# Altium schematic sheet BMS_AFE.SchDoc
size Tabloid; SheetNumber: 1; SheetTotal: 3
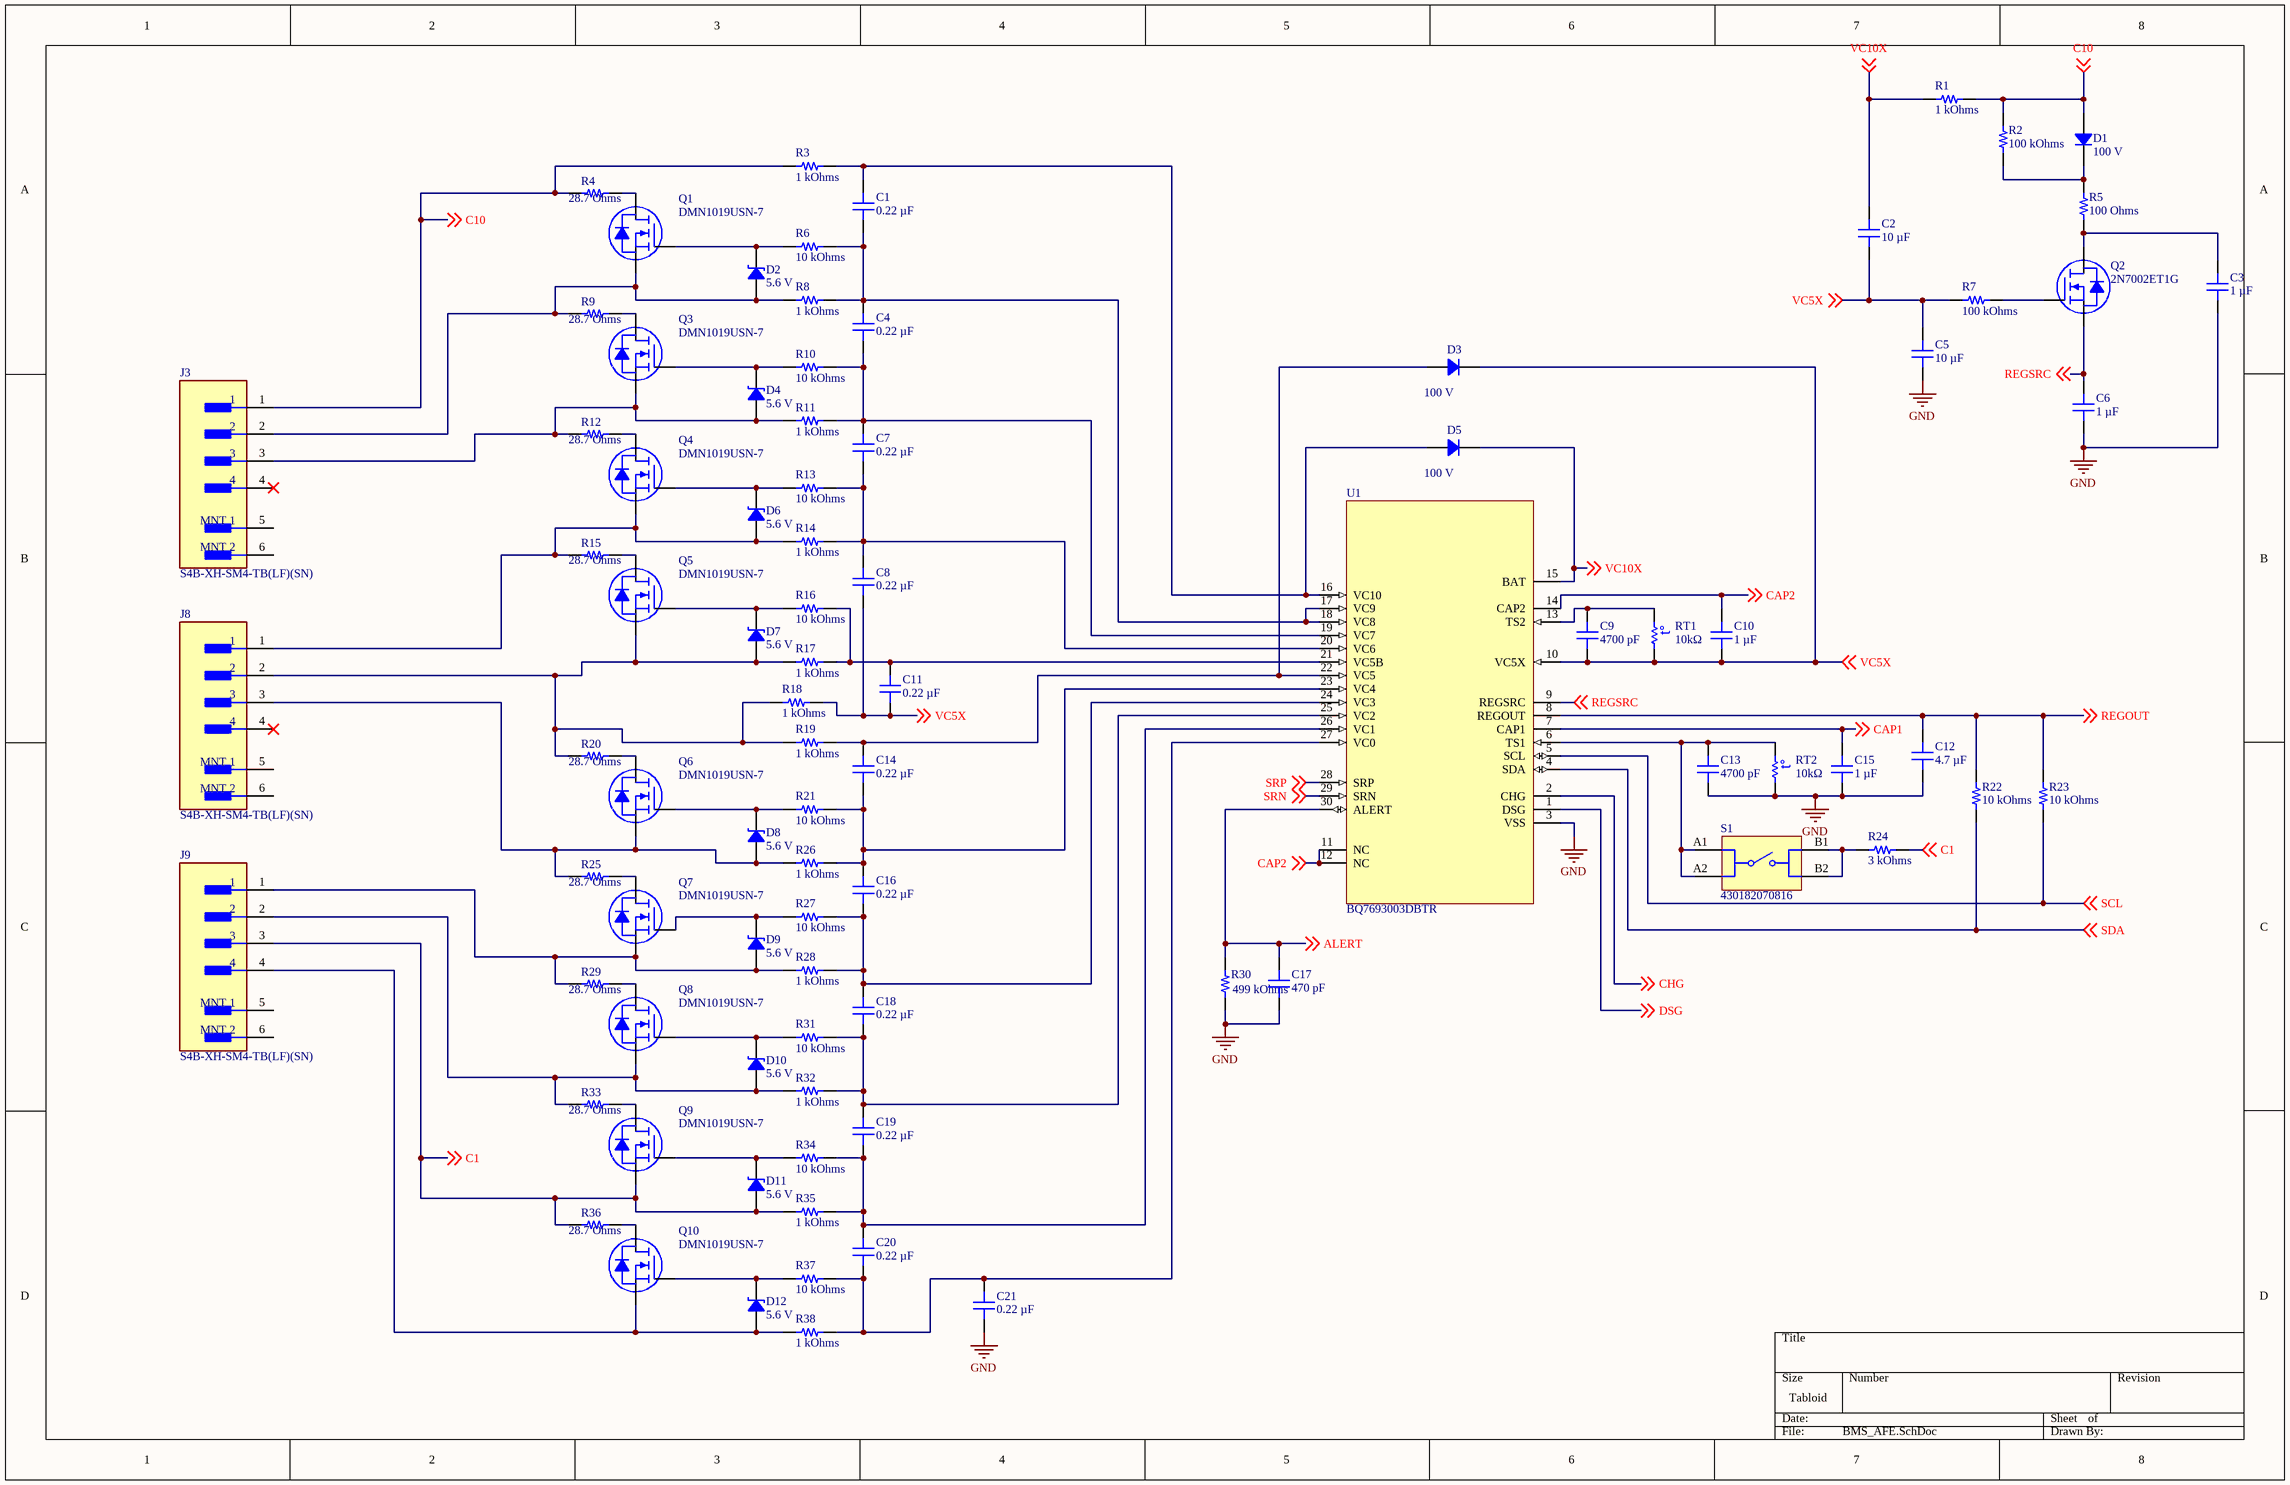
[diagram p0: BMS_AFE.SchDoc]

## Parts
C1  0.22 µF  [CAP 0603_1608]
C2  10 µF  [CAP 1210_3225 - 1MM]
C3  1 µF  [CAP 0805_2012]
C4  0.22 µF  [CAP 0603_1608]
C5  10 µF  [CAP 1210_3225 - 1MM]
C6  1 µF  [CAP 0805_2012]
C7  0.22 µF  [CAP 0603_1608]
C8  0.22 µF  [CAP 0603_1608]
C9  4700 pF  [CAP 0603_1608]
C10  1 µF  [CAP 0603_1608]
C11  0.22 µF  [CAP 0603_1608]
C12  4.7 µF  [CAP 0805_2012]
C13  4700 pF  [CAP 0603_1608]
C14  0.22 µF  [CAP 0603_1608]
C15  1 µF  [CAP 0603_1608]
C16  0.22 µF  [CAP 0603_1608]
C17  470 pF  [CAP 0603_1608]
C18  0.22 µF  [CAP 0603_1608]
C19  0.22 µF  [CAP 0603_1608]
C20  0.22 µF  [CAP 0603_1608]
C21  0.22 µF  [CAP 0603_1608]
D1  Voltage - DC Reverse (Vr) (Max): 100 V  [SOD-123]  (hidden comment: 1N4148W-7-F)
D2  Voltage - Zener (Nom) (Vz): 5.6 V  [SOD323]  (hidden comment: MMSZ5232BS-7-F)
D3  Voltage - DC Reverse (Vr) (Max): 100 V  [SOD-123]  (hidden comment: 1N4148W-7-F)
D4  Voltage - Zener (Nom) (Vz): 5.6 V  [SOD323]  (hidden comment: MMSZ5232BS-7-F)
D5  Voltage - DC Reverse (Vr) (Max): 100 V  [SOD-123]  (hidden comment: 1N4148W-7-F)
D6  Voltage - Zener (Nom) (Vz): 5.6 V  [SOD323]  (hidden comment: MMSZ5232BS-7-F)
D7  Voltage - Zener (Nom) (Vz): 5.6 V  [SOD323]  (hidden comment: MMSZ5232BS-7-F)
D8  Voltage - Zener (Nom) (Vz): 5.6 V  [SOD323]  (hidden comment: MMSZ5232BS-7-F)
D9  Voltage - Zener (Nom) (Vz): 5.6 V  [SOD323]  (hidden comment: MMSZ5232BS-7-F)
D10  Voltage - Zener (Nom) (Vz): 5.6 V  [SOD323]  (hidden comment: MMSZ5232BS-7-F)
D11  Voltage - Zener (Nom) (Vz): 5.6 V  [SOD323]  (hidden comment: MMSZ5232BS-7-F)
D12  Voltage - Zener (Nom) (Vz): 5.6 V  [SOD323]  (hidden comment: MMSZ5232BS-7-F)
J3  S4B-XH-SM4-TB(LF)(SN)  [FP-S4B-XH-SM4-TB_LF_SN-MFG]
J8  S4B-XH-SM4-TB(LF)(SN)  [FP-S4B-XH-SM4-TB_LF_SN-MFG]
J9  S4B-XH-SM4-TB(LF)(SN)  [FP-S4B-XH-SM4-TB_LF_SN-MFG]
Q1  DMN1019USN-7  [DIODES SOT-23-3]
Q2  2N7002ET1G  [ON SEMI SOT-23-3]
Q3  DMN1019USN-7  [DIODES SOT-23-3]
Q4  DMN1019USN-7  [DIODES SOT-23-3]
Q5  DMN1019USN-7  [DIODES SOT-23-3]
Q6  DMN1019USN-7  [DIODES SOT-23-3]
Q7  DMN1019USN-7  [DIODES SOT-23-3]
Q8  DMN1019USN-7  [DIODES SOT-23-3]
Q9  DMN1019USN-7  [DIODES SOT-23-3]
Q10  DMN1019USN-7  [DIODES SOT-23-3]
R1  1 kOhms  [RES 0603_1608]
R2  100 kOhms  [RES 0805_2012]
R3  1 kOhms  [RES 0603_1608]
R4  28.7 Ohms  [RES 2512_6432]
R5  100 Ohms  [RES 0805_2012]
R6  10 kOhms  [RES 0603_1608]
R7  100 kOhms  [RES 0805_2012]
R8  1 kOhms  [RES 0603_1608]
R9  28.7 Ohms  [RES 2512_6432]
R10  10 kOhms  [RES 0603_1608]
R11  1 kOhms  [RES 0603_1608]
R12  28.7 Ohms  [RES 2512_6432]
R13  10 kOhms  [RES 0603_1608]
R14  1 kOhms  [RES 0603_1608]
R15  28.7 Ohms  [RES 2512_6432]
R16  10 kOhms  [RES 0603_1608]
R17  1 kOhms  [RES 0603_1608]
R18  1 kOhms  [RES 0603_1608]
R19  1 kOhms  [RES 0603_1608]
R20  28.7 Ohms  [RES 2512_6432]
R21  10 kOhms  [RES 0603_1608]
R22  10 kOhms  [RES 0603_1608]
R23  10 kOhms  [RES 0603_1608]
R24  3 kOhms  [RES 0603_1608]
R25  28.7 Ohms  [RES 2512_6432]
R26  1 kOhms  [RES 0603_1608]
R27  10 kOhms  [RES 0603_1608]
R28  1 kOhms  [RES 0603_1608]
R29  28.7 Ohms  [RES 2512_6432]
R30  499 kOhms  [RES 0603_1608]
R31  10 kOhms  [RES 0603_1608]
R32  1 kOhms  [RES 0603_1608]
R33  28.7 Ohms  [RES 2512_6432]
R34  10 kOhms  [RES 0603_1608]
R35  1 kOhms  [RES 0603_1608]
R36  28.7 Ohms  [RES 2512_6432]
R37  10 kOhms  [RES 0603_1608]
R38  1 kOhms  [RES 0603_1608]
RT1  Resistance: 10kΩ  [FP-103AT-2-MFG]  (hidden comment: 103AT-2)
RT2  Resistance: 10kΩ  [FP-103AT-2-MFG]  (hidden comment: 103AT-2)
S1  430182070816  [430182070816]
U1  BQ7693003DBTR  [FP-DBT0030A-IPC_C]

## Nets
GND: C3.1 C5.1 C6.1 C12.1 C13.1 C15.2 C17.1 C21.1 R30.1 RT2.1 U1.3(VSS)
ALERT: C17.2 R30.2 U1.30(ALERT) ; off-sheet ALERT
C1: D11.1 J9.3 Q9.2(S) R24.2 R35.1 R36.1 ; off-sheet C1
C10: D1.1 J3.1 R1.2 R2.2 R3.1 R4.1 ; off-sheet C10
CAP1: C15.1 U1.7(CAP1) ; off-sheet CAP1
CAP2: C10.1 U1.11(NC) U1.12(NC) U1.14(CAP2) ; off-sheet CAP2
CHG: U1.2(CHG) ; off-sheet CHG
DSG: U1.1(DSG) ; off-sheet DSG
REGOUT: C12.2 R22.2 R23.2 U1.8(REGOUT) ; off-sheet REGOUT
REGSRC: C6.2 Q2.2(S) U1.9(REGSRC) ; off-sheet REGSRC
SCL: R23.1 U1.5(SCL) ; off-sheet SCL
SDA: R22.1 U1.4(SDA) ; off-sheet SDA
SRN: U1.29(SRN) ; off-sheet SRN
SRP: U1.28(SRP) ; off-sheet SRP
VC5X: C2.1 C5.2 C8.1 C9.1 C10.2 C11.1 D3.2 R7.1 R18.2 RT1.1 U1.10(VC5X) ; off-sheet VC5X
VC10X: C2.2 D5.2 R1.1 U1.15(BAT) ; off-sheet VC10X
NetC1_1: C1.1 C4.2 R6.2 R8.2 U1.17(VC9) U1.18(VC8)
NetC1_2: C1.2 D5.1 R3.2 U1.16(VC10)
NetC3_2: C3.2 Q2.3(D) R5.1
NetC4_1: C4.1 C7.2 R10.2 R11.2 U1.19(VC7)
NetC7_1: C7.1 C8.2 R13.2 R14.2 U1.20(VC6)
NetC9_2: C9.2 RT1.2 U1.13(TS2)
NetC11_2: C11.2 R16.2 R17.2 U1.21(VC5B)
NetC13_2: C13.2 RT2.2 S1.A1 S1.A2 U1.6(TS1)
NetC14_1: C14.1 C16.2 R21.2 R26.2 U1.23(VC4)
NetC14_2: C14.2 D3.1 R19.2 U1.22(VC5)
NetC16_1: C16.1 C18.2 R27.2 R28.2 U1.24(VC3)
NetC18_1: C18.1 C19.2 R31.2 R32.2 U1.25(VC2)
NetC19_1: C19.1 C20.2 R34.2 R35.2 U1.26(VC1)
NetC20_1: C20.1 C21.2 R37.2 R38.2 U1.27(VC0)
NetD1_2: D1.2 R2.1 R5.2
NetD2_1: D2.1 J3.2 Q1.2(S) R8.1 R9.1
NetD2_2: D2.2 Q1.1(G) R6.1
NetD4_1: D4.1 J3.3 Q3.2(S) R11.1 R12.1
NetD4_2: D4.2 Q3.1(G) R10.1
NetD6_1: D6.1 J8.1 Q4.2(S) R14.1 R15.1
NetD6_2: D6.2 Q4.1(G) R13.1
NetD7_1: D7.1 J8.2 Q5.2(S) R17.1 R18.1 R19.1 R20.1
NetD7_2: D7.2 Q5.1(G) R16.1
NetD8_1: D8.1 J8.3 Q6.2(S) R25.1 R26.1
NetD8_2: D8.2 Q6.1(G) R21.1
NetD9_1: D9.1 J9.1 Q7.2(S) R28.1 R29.1
NetD9_2: D9.2 Q7.1(G) R27.1
NetD10_1: D10.1 J9.2 Q8.2(S) R32.1 R33.1
NetD10_2: D10.2 Q8.1(G) R31.1
NetD11_2: D11.2 Q9.1(G) R34.1
NetD12_1: D12.1 J9.4 Q10.2(S) R38.1
NetD12_2: D12.2 Q10.1(G) R37.1
NetQ1_3: Q1.3(D) R4.2
NetQ2_1: Q2.1(G) R7.2
NetQ3_3: Q3.3(D) R9.2
NetQ4_3: Q4.3(D) R12.2
NetQ5_3: Q5.3(D) R15.2
NetQ6_3: Q6.3(D) R20.2
NetQ7_3: Q7.3(D) R25.2
NetQ8_3: Q8.3(D) R29.2
NetQ9_3: Q9.3(D) R33.2
NetQ10_3: Q10.3(D) R36.2
NetR24_1: R24.1 S1.B1 S1.B2

Not connected (* = marked no-connect by the designer): J3 4* 5(MNT_1) 6(MNT_2); J8 4* 5(MNT_1) 6(MNT_2); J9 5(MNT_1) 6(MNT_2)

## Notes on the sheet
- (in symbol 103AT-2) t°

## Library data of the parts
C1 C4 C7 C8 C11 C14 C16 C18-C21 = 885012206048: CAP CER 0.22UF 16V X7R 0603; manufacturer: Würth Elektronik; Tolerance: ±10%; Part Number: 885012206048; Capacitance: 0.22 µF; Applications: General Purpose; componentlink1description: Datasheet; componentlink1url: https://katalog.we-online.de/pbs/datasheet/885012206048.pdf; componentlink2description: DigiKey Link; componentlink2url: https://www.digikey.com/en/products/detail/würth-elektronik/885012206048/5453822; Device Package: 0603 (1608 Metric); lastupdated: 2/9/2024 8:10:22 PM; Lifecycle Status: Active; Minimum Order: 1; Mounting Type: Surface Mount, MLCC; Operating Temperature: -55°C ~ 125°C; Package / Case: 0603 (1608 Metric); packaging: TapeAndReel; partid: 8781; Part Status: Active; price: 0.03; series: WCAP-CSGP; Size / Dimension: 0.063" L x 0.031" W (1.60mm x 0.80mm); Supplier 1: DigiKey; Supplier Part Number 1: 732-7967-1-ND; Temperature Coefficient: X7R; Thickness (Max): 0.034" (0.87mm); value: 0.22 µF; Voltage - Rated: 16V
C2 C5 = CL32B106KLJNNNE: CAP CER 10UF 35V X7R 1210; manufacturer: Samsung Electro-Mechanics; Tolerance: ±10%; Part Number: CL32B106KLJNNNE; Value: 10 µF; Applications: General Purpose; Capacitance: 10 µF; componentlink1description: Datasheet; componentlink1url: http://www.samsungsem.com/kr/support/product-search/mlcc/CL32B106KLJNNNE.jsp; componentlink2description: DigiKey Link; componentlink2url: https://www.digikey.com/en/products/detail/samsung-electro-mechanics/CL32B106KLJNNNE/3889047; Device Package: 1210 (3225 Metric); lastupdated: 6/4/2024 7:20:58 PM; Lifecycle Status: Active; Minimum Order: 1; Mounting Type: Surface Mount, MLCC; Operating Temperature: -55°C ~ 125°C; Package / Case: 1210 (3225 Metric); packaging: TapeAndReel; partid: 41408; Part Status: Active; price: 0.08; series: CL; Size / Dimension: 0.126" L x 0.098" W (3.20mm x 2.50mm); Supplier 1: DigiKey; Supplier Part Number 1: 1276-3389-1-ND; Temperature Coefficient: X7R; Thickness (Max): 0.106" (2.70mm); Voltage - Rated: 35V
C3 C6 = GCJ21BR71H105KA01L: CAP CER 1UF 50V X7R 0805; manufacturer: Murata Electronics; Tolerance: ±10%; Part Number: GCJ21BR71H105KA01L; Capacitance: 1 µF; Applications: Automotive, Boardflex Sensitive; componentlink1description: Datasheet; componentlink1url: https://www.murata.com/~/media/webrenewal/support/library/catalog/products/capacitor/mlcc/c03e.ashx?la=en-us; componentlink2description: DigiKey Link; componentlink2url: https://www.digikey.com/en/products/detail/murata-electronics/GCJ21BR71H105KA01L/4903512; Device Package: 0805 (2012 Metric); Features: Soft Termination; lastupdated: 2/9/2024 8:16:08 PM; Lifecycle Status: Active; Minimum Order: 1; Mounting Type: Surface Mount, MLCC; Operating Temperature: -55°C ~ 125°C; Package / Case: 0805 (2012 Metric); packaging: TapeAndReel; partid: 2709; Part Status: Active; price: 0.05; Ratings: AEC-Q200; series: GCJ; Size / Dimension: 0.079" L x 0.049" W (2.00mm x 1.25mm); Supplier 1: DigiKey; Supplier Part Number 1: 490-10667-1-ND; Temperature Coefficient: X7R; Thickness (Max): 0.057" (1.45mm); value: 1 µF; Voltage - Rated: 50V
C9 C13 = 885012206087: CAP CER 4700PF 50V X7R 0603; manufacturer: Würth Elektronik; Tolerance: ±10%; Part Number: 885012206087; Capacitance: 4700 pF; Applications: General Purpose; componentlink1description: Datasheet; componentlink1url: https://katalog.we-online.de/pbs/datasheet/885012206087.pdf; componentlink2description: DigiKey Link; componentlink2url: https://www.digikey.com/en/products/detail/würth-elektronik/885012206087/5453860; Device Package: 0603 (1608 Metric); lastupdated: 2/9/2024 8:10:29 PM; Lifecycle Status: Active; Minimum Order: 1; Mounting Type: Surface Mount, MLCC; Operating Temperature: -55°C ~ 125°C; Package / Case: 0603 (1608 Metric); packaging: TapeAndReel; partid: 3486; Part Status: Active; price: 0.01; series: WCAP-CSGP; Size / Dimension: 0.063" L x 0.031" W (1.60mm x 0.80mm); Supplier 1: DigiKey; Supplier Part Number 1: 732-8005-1-ND; Temperature Coefficient: X7R; Thickness (Max): 0.037" (0.95mm); value: 4700 pF; Voltage - Rated: 50V
C10 C15 = 885012206052: CAP CER 1UF 16V X7R 0603; manufacturer: Würth Elektronik; Tolerance: ±10%; Part Number: 885012206052; Capacitance: 1 µF; Applications: General Purpose; componentlink1description: Datasheet; componentlink1url: https://katalog.we-online.de/pbs/datasheet/885012206052.pdf; componentlink2description: DigiKey Link; componentlink2url: https://www.digikey.com/en/products/detail/würth-elektronik/885012206052/5453826; Device Package: 0603 (1608 Metric); lastupdated: 2/9/2024 8:10:16 PM; Lifecycle Status: Active; Minimum Order: 1; Mounting Type: Surface Mount, MLCC; Operating Temperature: -55°C ~ 125°C; Package / Case: 0603 (1608 Metric); packaging: TapeAndReel; partid: 13198; Part Status: Active; price: 0.11; series: WCAP-CSGP; Size / Dimension: 0.063" L x 0.031" W (1.60mm x 0.80mm); Supplier 1: DigiKey; Supplier Part Number 1: 732-7971-1-ND; Temperature Coefficient: X7R; Thickness (Max): 0.037" (0.95mm); value: 1 µF; Voltage - Rated: 16V
C12 = 885012207025: CAP CER 4.7UF 10V X7R 0805; manufacturer: Würth Elektronik; Tolerance: ±10%; Part Number: 885012207025; Capacitance: 4.7 µF; Applications: General Purpose; componentlink1description: Datasheet; componentlink1url: https://katalog.we-online.de/pbs/datasheet/885012207025.pdf; componentlink2description: DigiKey Link; componentlink2url: https://www.digikey.com/en/products/detail/würth-elektronik/885012207025/5453512; Device Package: 0805 (2012 Metric); lastupdated: 2/9/2024 8:15:22 PM; Lifecycle Status: Active; Minimum Order: 1; Mounting Type: Surface Mount, MLCC; Operating Temperature: -55°C ~ 125°C; Package / Case: 0805 (2012 Metric); packaging: TapeAndReel; partid: 17499; Part Status: Active; price: 0.55; series: WCAP-CSGP; Size / Dimension: 0.079" L x 0.049" W (2.00mm x 1.25mm); Supplier 1: DigiKey; Supplier Part Number 1: 732-7657-1-ND; Temperature Coefficient: X7R; Thickness (Max): 0.057" (1.45mm); value: 4.7 µF; Voltage - Rated: 10V
C17 = 885012206081: CAP CER 470PF 50V X7R 0603; manufacturer: Würth Elektronik; Tolerance: ±10%; Part Number: 885012206081; Capacitance: 470 pF; Applications: General Purpose; componentlink1description: Datasheet; componentlink1url: https://katalog.we-online.de/pbs/datasheet/885012206081.pdf; componentlink2description: DigiKey Link; componentlink2url: https://www.digikey.com/en/products/detail/würth-elektronik/885012206081/5453854; Device Package: 0603 (1608 Metric); lastupdated: 2/9/2024 8:10:11 PM; Lifecycle Status: Active; Minimum Order: 1; Mounting Type: Surface Mount, MLCC; Operating Temperature: -55°C ~ 125°C; Package / Case: 0603 (1608 Metric); packaging: TapeAndReel; partid: 15743; Part Status: Active; price: 0.02; series: WCAP-CSGP; Size / Dimension: 0.063" L x 0.031" W (1.60mm x 0.80mm); Supplier 1: DigiKey; Supplier Part Number 1: 732-7999-1-ND; Temperature Coefficient: X7R; Thickness (Max): 0.037" (0.95mm); value: 470 pF; Voltage - Rated: 50V
D1 D3 D5 = 1N4148W-7-F: DIODE GEN PURP 100V 300MA SOD123; Manufacturer: Diodes Incorporated; Capacitance @ Vr, F: 2pF @ 0V, 1MHz; Current - Reverse Leakage @ Vr: 1 µA @ 100 V; Diode Type: Standard; Reverse Recovery Time (trr): 4 ns; Speed: Fast Recovery =< 500ns, > 200mA (Io); Voltage - Forward (Vf) (Max) @ If: 1.25 V @ 150 mA; Part Number: 1N4148W-7-F; ComponentLink1Description: Datasheet; ComponentLink1URL: https://www.diodes.com/assets/Datasheets/ds30086.pdf; ComponentLink2Description: DigiKey Link; ComponentLink2URL: https://www.digikey.com/en/products/detail/diodes-incorporated/1N4148W-7-F/814371; Current - Average Rectified (Io): 300mA; LastUpdated: 6/3/2024 7:54:46 PM; Lifecycle Status: Active; Minimum Order: 1; Mounting Type: Surface Mount; Operating Temperature - Junction: -55°C ~ 150°C; Package / Case: SOD-123; Packaging: TapeAndReel; PartId: 1002; Part Status: Active; Price: 0.02; Series: -; Supplier 1: DigiKey; Supplier Part Number 1: 1N4148W-FDICT-ND; Supplier Device Package: SOD-123
D2 D4 D6-D12 = MMSZ5232BS-7-F: DIODE ZENER 5.6V 200MW SOD323; Manufacturer: Diodes Incorporated; Current - Reverse Leakage @ Vr: 5 µA @ 3 V; Impedance (Max) (Zzt): 11 Ohms; Tolerance: ±5%; Voltage - Forward (Vf) (Max) @ If: 900 mV @ 10 mA; Part Number: MMSZ5232BS-7-F; ComponentLink1Description: Datasheet; ComponentLink1URL: https://www.diodes.com/assets/Datasheets/ds31038.pdf; ComponentLink2Description: DigiKey Link; ComponentLink2URL: https://www.digikey.com/en/products/detail/diodes-incorporated/MMSZ5232BS-7-F/814356; LastUpdated: 6/3/2024 8:20:26 PM; Lifecycle Status: Active; Minimum Order: 1; Mounting Type: Surface Mount; Operating Temperature: -65°C ~ 150°C; Package / Case: SC-76, SOD-323; Packaging: TapeAndReel; PartId: 3555; Part Status: Active; Power - Max: 200 mW; Price: 0.03; Series: -; Supplier 1: DigiKey; Supplier Part Number 1: MMSZ5232BS-FDICT-ND; Supplier Device Package: SOD-323
J3 J8 J9 = S4B-XH-SM4-TB: CONN HEADER SMD R/A 4POS 2.5MM; Number of Positions: 4; Max Current Rating: 3A; Max Voltage Rating (AC): 250V; Connector Type: Male Pin; Contact Resistance: 20mR; Gender: Male; Pitch: 0.098inch; Max Operating Temperature: 85°C; Contact Plating: Tin; Housing Material: Polyamide; Housing Color: Beige; Depth: 10mm; Series: XH; Package Quantity: 1; Length: 15mm; Contact Material: Copper Alloy; Min Operating Temperature: -25°C; REACH SVHC: No SVHC; Orientation: Right Angle; Number of Rows: 1; Contact Type: Male Pin; Color: Natural; Lead Free: Lead Free; Termination: Solder; Mount: Surface Mount; Number of Contacts: 4; Packaging: Tape and Reel; Supplier 1: Mouser; Supplier Part Number 1: 306-S4BXHSM4TBLFSN
Q1 Q3-Q10 = DMN1019USN-7: MOSFET N-CH 12V 9.3A SC59; Manufacturer: Diodes Incorporated; Current - Continuous Drain (Id) @ 25°C: 9.3A (Ta); Drive Voltage (Max Rds On,  Min Rds On): 1.2V, 2.5V; FET Type: N-Channel; Gate Charge (Qg) (Max) @ Vgs: 50.6 nC @ 8 V; Input Capacitance (Ciss) (Max) @ Vds: 2426 pF @ 10 V; Power Dissipation (Max): 680mW (Ta); Rds On (Max) @ Id, Vgs: 10mOhm @ 9.7A, 4.5V; Vgs (Max): ±8V; Vgs(th) (Max) @ Id: 800mV @ 250µA; Part Number: DMN1019USN-7; ComponentLink1Description: Datasheet; ComponentLink1URL: https://www.diodes.com/assets/Datasheets/DMN1019USN.pdf; ComponentLink2Description: DigiKey Link; ComponentLink2URL: https://www.digikey.com/en/products/detail/diodes-incorporated/DMN1019USN-7/4898853; Drain to Source Voltage (Vdss): 12 V; LastUpdated: 6/3/2024 8:15:16 PM; Lifecycle Status: Active; Minimum Order: 1; Mounting Type: Surface Mount; Operating Temperature: -55°C ~ 150°C (TJ); Package / Case: TO-236-3, SC-59, SOT-23-3; Packaging: TapeAndReel; Part Status: Active; Price: 0.10; Series: -; Supplier 1: DigiKey; Supplier Part Number 1: DMN1019USN-7DICT-ND; Supplier Device Package: SC-59-3; Technology: MOSFET (Metal Oxide)
Q2 = 2N7002ET1G: MOSFET N-CH 60V 260MA SOT-23; Manufacturer: ON Semiconductor; Current - Continuous Drain (Id) @ 25°C: 260mA (Ta); Drive Voltage (Max Rds On,  Min Rds On): 4.5V, 10V; FET Type: N-Channel; Gate Charge (Qg) (Max) @ Vgs: 0.81nC @ 5V; Input Capacitance (Ciss) (Max) @ Vds: 26.7pF @ 25V; Power Dissipation (Max): 300mW (Tj); Rds On (Max) @ Id, Vgs: 2.5Ohm @ 240mA, 10V; Vgs (Max): ±20V; Vgs(th) (Max) @ Id: 2.5V @ 250µA; Part Number: 2N7002ET1G; ComponentLink1Description: Datasheet; ComponentLink1URL: http://www.onsemi.com/pub/Collateral/2N7002E-D.PDF; ComponentLink2Description: DigiKey Link; ComponentLink2URL: http://digikey.com/product-detail/en/on-semiconductor/2N7002ET1G/2N7002ET1GOSCT-ND/1967029; Drain to Source Voltage (Vdss): 60V; LastUpdated: 6/3/2024 8:15:26 PM; Lifecycle Status: Active; Minimum Order: 1; Mounting Type: Surface Mount; Operating Temperature: -55°C ~ 150°C (TJ); Package / Case: TO-236-3, SC-59, SOT-23-3; Packaging: TapeAndReel; Part Status: Active; Price: 0.03; Series: -; Supplier 1: DigiKey; Supplier Part Number 1: 2N7002ET1GOSCT-ND; Supplier Device Package: SOT-23-3 (TO-236); Technology: MOSFET (Metal Oxide)
R1 R3 R8 R11 R14 R17-R19 R26 R28 R32 R35 R38 = CRCW06031K00JNEA: RES SMD 1K OHM 5% 1/10W 0603; Manufacturer: Vishay Dale; Power (Watts): 0.1W, 1/10W; Temperature Coefficient: ±200ppm/°C; Part Number: CRCW06031K00JNEA; Value: 1 kOhms; ComponentLink1Description: Datasheet; ComponentLink1URL: http://www.vishay.com/docs/20035/dcrcwe3.pdf; ComponentLink2Description: DigiKey Link; ComponentLink2URL: https://www.digikey.com/en/products/detail/vishay-dale/CRCW06031K00JNEA/1174229; Composition: Thick Film; Device Package: 0603 (1608 Metric); Features: Automotive AEC-Q200; Height - Seated (Max): 0.020" (0.50mm); LastUpdated: 2/9/2024 8:42:33 PM; Lifecycle Status: Active; Minimum Order: 1; Number of Terminations: 2; Operating Temperature: -55°C ~ 155°C; Package / Case: 0603 (1608 Metric); Packaging: TapeAndReel; PartId: 21209; Part Status: Active; Price: 0.01; Ratings: AEC-Q200; Resistance: 1 kOhms; Series: CRCW; Size / Dimension: 0.063" L x 0.033" W (1.60mm x 0.85mm); Supplier 1: DigiKey; Supplier Part Number 1: 541-1.0KGCT-ND; Supplier Device Package: 0603; Tolerance: ±5%
R2 R7 = CRCW0805100KFKEA: RES SMD 100K OHM 1% 1/8W 0805; Manufacturer: Vishay Dale; Power (Watts): 0.125W, 1/8W; Temperature Coefficient: ±100ppm/°C; Part Number: CRCW0805100KFKEA; Value: 100 kOhms; ComponentLink1Description: Datasheet; ComponentLink1URL: http://www.vishay.com/docs/20035/dcrcwe3.pdf; ComponentLink2Description: DigiKey Link; ComponentLink2URL: https://www.digikey.com/en/products/detail/vishay-dale/CRCW0805100KFKEA/1175865; Composition: Thick Film; Device Package: 0805 (2012 Metric); Features: Automotive AEC-Q200; Height - Seated (Max): 0.020" (0.50mm); LastUpdated: 2/8/2024 9:02:17 PM; Lifecycle Status: Active; Minimum Order: 1; Number of Terminations: 2; Operating Temperature: -55°C ~ 155°C; Package / Case: 0805 (2012 Metric); Packaging: TapeAndReel; PartId: 32640; Part Status: Active; Price: 0.01; Ratings: AEC-Q200; Resistance: 100 kOhms; Series: CRCW; Size / Dimension: 0.079" L x 0.049" W (2.00mm x 1.25mm); Supplier 1: DigiKey; Supplier Part Number 1: 541-100KCCT-ND; Supplier Device Package: 0805; Tolerance: ±1%
R4 R9 R12 R15 R20 R25 R29 R33 R36 = CRCW251228R7FKEG: RES SMD 28.7 OHM 1% 1W 2512; manufacturer: Vishay Dale; Temperature Coefficient: ±100ppm/°C; value: 28.7 Ohms; componentlink1description: Datasheet; componentlink1url: http://www.vishay.com/docs/20035/dcrcwe3.pdf; Supplier 1: DigiKey; Supplier Part Number 1: 541-28.7AFCT-ND; Part Number: CRCW251228R7FKEG; componentlink2description: DigiKey Link; componentlink2url: http://digikey.com/product-detail/en/vishay-dale/CRCW251228R7FKEG/541-28.7AFCT-ND/1178678; Composition: Thick Film; Device Package: 2512 (6432 Metric); Features: Automotive AEC-Q200; Height - Seated (Max): 0.028" (0.70mm); lastupdated: 9/2/2020 1:26:59 AM; Lifecycle Status: Active; Minimum Order: 1; Number of Terminations: 2; Operating Temperature: -55°C ~ 155°C; Package / Case: 2512 (6432 Metric); packaging: TapeAndReel; Part Status: Active; Power (Watts): 1W; price: 0.04; Ratings: AEC-Q200; Resistance: 28.7 Ohms; series: CRCW; Size / Dimension: 0.248" L x 0.124" W (6.30mm x 3.15mm); Supplier Device Package: 2512; Tolerance: ±1%
R5 = CRCW0805100RFKEA: RES SMD 100 OHM 1% 1/8W 0805; Manufacturer: Vishay Dale; Power (Watts): 0.125W, 1/8W; Temperature Coefficient: ±100ppm/°C; Part Number: CRCW0805100RFKEA; Value: 100 Ohms; ComponentLink1Description: Datasheet; ComponentLink1URL: http://www.vishay.com/docs/20035/dcrcwe3.pdf; ComponentLink2Description: DigiKey Link; ComponentLink2URL: https://www.digikey.com/en/products/detail/vishay-dale/CRCW0805100RFKEA/1175523; Composition: Thick Film; Device Package: 0805 (2012 Metric); Features: Automotive AEC-Q200; Height - Seated (Max): 0.020" (0.50mm); LastUpdated: 2/8/2024 9:02:37 PM; Lifecycle Status: Active; Minimum Order: 1; Number of Terminations: 2; Operating Temperature: -55°C ~ 155°C; Package / Case: 0805 (2012 Metric); Packaging: TapeAndReel; PartId: 28106; Part Status: Active; Price: 0.01; Ratings: AEC-Q200; Resistance: 100 Ohms; Series: CRCW; Size / Dimension: 0.079" L x 0.049" W (2.00mm x 1.25mm); Supplier 1: DigiKey; Supplier Part Number 1: 541-100CCT-ND; Supplier Device Package: 0805; Tolerance: ±1%
R6 R10 R13 R16 R21-R23 R27 R31 R34 R37 = CRCW060310K0JNEA: RES SMD 10K OHM 5% 1/10W 0603; Manufacturer: Vishay Dale; Power (Watts): 0.1W, 1/10W; Temperature Coefficient: ±200ppm/°C; Part Number: CRCW060310K0JNEA; Value: 10 kOhms; ComponentLink1Description: Datasheet; ComponentLink1URL: http://www.vishay.com/docs/20035/dcrcwe3.pdf; ComponentLink2Description: DigiKey Link; ComponentLink2URL: https://www.digikey.com/en/products/detail/vishay-dale/CRCW060310K0JNEA/1174253; Composition: Thick Film; Device Package: 0603 (1608 Metric); Features: Automotive AEC-Q200; Height - Seated (Max): 0.020" (0.50mm); LastUpdated: 2/9/2024 8:43:35 PM; Lifecycle Status: Active; Minimum Order: 1; Number of Terminations: 2; Operating Temperature: -55°C ~ 155°C; Package / Case: 0603 (1608 Metric); Packaging: CutTape; PartId: 5216; Part Status: Active; Price: 0.01; Ratings: AEC-Q200; Resistance: 10 kOhms; Series: CRCW; Size / Dimension: 0.063" L x 0.033" W (1.60mm x 0.85mm); Supplier 1: DigiKey; Supplier Part Number 1: 541-10KGCT-ND; Supplier Device Package: 0603; Tolerance: ±5%
R24 = CRCW06033K00JNEA: RES SMD 3K OHM 5% 1/10W 0603; Manufacturer: Vishay Dale; Power (Watts): 0.1W, 1/10W; Temperature Coefficient: ±200ppm/°C; Part Number: CRCW06033K00JNEA; Value: 3 kOhms; ComponentLink1Description: Datasheet; ComponentLink1URL: http://www.vishay.com/docs/20035/dcrcwe3.pdf; ComponentLink2Description: DigiKey Link; ComponentLink2URL: https://www.digikey.com/en/products/detail/vishay-dale/CRCW06033K00JNEA/1174240; Composition: Thick Film; Device Package: 0603 (1608 Metric); Features: Automotive AEC-Q200; Height - Seated (Max): 0.020" (0.50mm); LastUpdated: 2/9/2024 8:42:33 PM; Lifecycle Status: Active; Minimum Order: 1; Number of Terminations: 2; Operating Temperature: -55°C ~ 155°C; Package / Case: 0603 (1608 Metric); Packaging: TapeAndReel; PartId: 21261; Part Status: Active; Price: 0.01; Ratings: AEC-Q200; Resistance: 3 kOhms; Series: CRCW; Size / Dimension: 0.063" L x 0.033" W (1.60mm x 0.85mm); Supplier 1: DigiKey; Supplier Part Number 1: 541-3.0KGCT-ND; Supplier Device Package: 0603; Tolerance: ±5%
R30 = CRCW0603499KFKEAHP: RES SMD 499K OHM 1% 1/3W 0603; Manufacturer: Vishay Dale; Power (Watts): 0.333W, 1/3W; Temperature Coefficient: ±100ppm/°C; Part Number: CRCW0603499KFKEAHP; Value: 499 kOhms; ComponentLink1Description: Datasheet; ComponentLink1URL: http://www.vishay.com/docs/20043/crcwhpe3.pdf; ComponentLink2Description: DigiKey Link; ComponentLink2URL: https://www.digikey.com/en/products/detail/vishay-dale/CRCW0603499KFKEAHP/2226474; Composition: Thick Film; Device Package: 0603 (1608 Metric); Features: Automotive AEC-Q200, Pulse Withstanding; Height - Seated (Max): 0.022" (0.55mm); LastUpdated: 2/9/2024 8:42:58 PM; Lifecycle Status: Active; Minimum Order: 1; Number of Terminations: 2; Operating Temperature: -55°C ~ 155°C; Package / Case: 0603 (1608 Metric); Packaging: TapeAndReel; PartId: 14787; Part Status: Active; Price: 0.02; Ratings: AEC-Q200; Resistance: 499 kOhms; Series: CRCW-HP; Size / Dimension: 0.063" L x 0.033" W (1.60mm x 0.85mm); Supplier 1: DigiKey; Supplier Part Number 1: 541-499KSCT-ND; Supplier Device Package: 0603; Tolerance: ±1%
RT1 RT2 = 103AT-2: Thermistor NTC 10KOhm 1% 2-Pin; Lead Pitch: 2.54mm; Height: 2.4mm; Max Operating Temperature: 110°C; Width: 3.7mm; RoHS Compliant: Yes; Min Operating Temperature: -50°C; Termination: Radial; Packaging: Bulk; Number of Pins: 2; Series: AT; Tolerance: 1%; Length: 17mm; Supplier 1: Mouser; Supplier Part Number 1: 954-103AT-2
S1 = 430182070816: Switch Tactile Spst-no 0.05A 12V; Life (Cycles): 1Mcycles; Switch Travel: 250µm; Throw Configuration: SPST; Switch Function: Off-Mom; Actuator Material: Liquid Crystal Polymer, Polymer; Contact Current Rating: 50mA; Illumination Type: Illuminated, Non-Illuminated; Insulation Resistance: 100MΩ; Actuator Length: 3.6mm; Color: Black; Mount: Surface Mount; Contact Material: Stainless Steel, Steel; REACH SVHC: No SVHC; Width: 6.2mm; Voltage Rating (DC): 12V; RoHS: Compliant; Length: 6.2mm; Height: 7mm; Current Rating: 50mA; Lead Free: Lead Free; Termination: Gull Wing; Min Operating Temperature: -40°C; Voltage Rating: 12V; Max Operating Temperature: 85°C; Diameter: 3mm; Contact Plating: Silver; Packaging: Tape and Reel; Mechanical Life: 1Mcycles; Contact Resistance: 100mΩ; Supplier 1: Mouser; Supplier Part Number 1: 710-430182070816
U1 = BQ7693003DBTR: IC BATT MGMT LI-ION AFE 30TSSOP; Manufacturer: Texas Instruments; Max Supply Voltage: 25V; Nominal Supply Current: 40-130uA; Number Of Outputs: 2; Number Of Cells: 10; Standoff Height: 0.05mm; Min Supply Voltage: 6V; Octopart: https://octopart.com/bq7693003dbtr-texas+instruments-34472212; Digikey Description: IC BATT MGMT LI-ION AFE 30TSSOP; Ipc Land Pattern Name: SOP50P635X120-30; Mouser Description: 6 to 10-Series Cell Li-Ion and Li-Phosphate Battery Monitor (bq76940 Family) 30-TSSOP -40 to 85; Package: DBT0030A; Manufacturer Part Number: BQ7693003DBTR; Device Class L1: Integrated Circuits (ICs); Temperature Range High: +85°C; RoHS: TRUE; Category: IC; Temperature: -40°C to +85°C; Automotive: No; Device Class L3: Battery Management; ComponentLink2Description: Datasheet; Device Class L2: Power Management ICs; ComponentLink2URL: http://www.ti.com/lit/ds/symlink/bq76930.pdf; Height: 1.2mm; Temperature Range Low: -40°C; Lead Free: Yes; Supplier 1: Mouser; Supplier Part Number 1: 595-BQ7693003DBTR; Supplier 2: Digikey; Supplier Part Number 2: 296-39961-1-ND